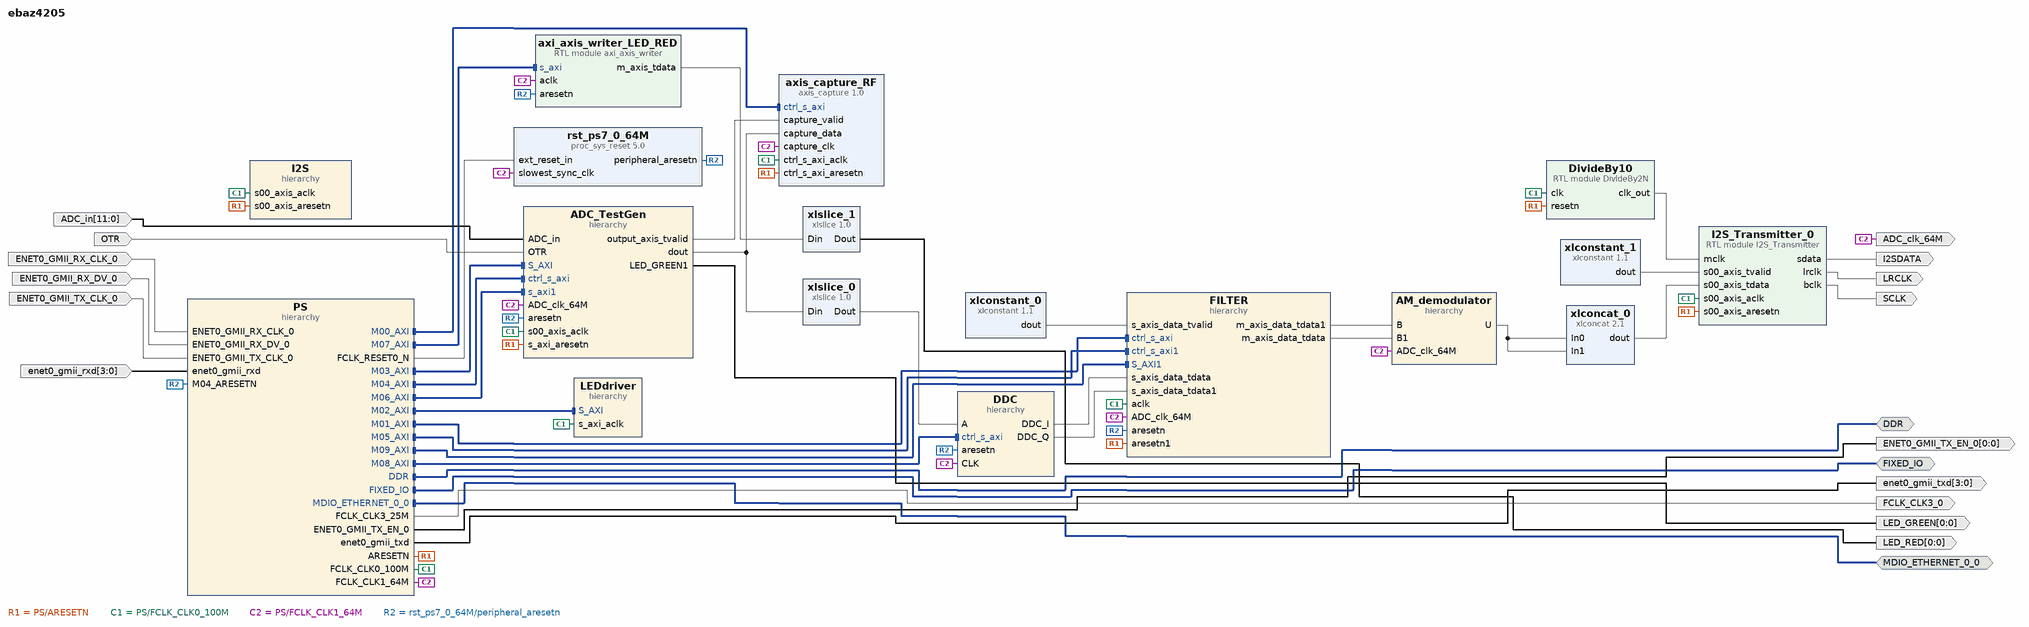
[diagram p0: block diagram of the top level]
# Vivado block design ebaz4205, xc7z010clg400-1, Vivado 2021.2
create_bd_design ebaz4205

create_bd_intf_port -mode Master -vlnv xilinx.com:interface:ddrx_rtl:1.0 DDR
create_bd_intf_port -mode Master -vlnv xilinx.com:display_processing_system7:fixedio_rtl:1.0 FIXED_IO
create_bd_intf_port -mode Master -vlnv xilinx.com:interface:mdio_rtl:1.0 MDIO_ETHERNET_0_0
create_bd_port -dir I -type clk ENET0_GMII_RX_CLK_0
create_bd_port -dir I ENET0_GMII_RX_DV_0
create_bd_port -dir I -type clk ENET0_GMII_TX_CLK_0
create_bd_port -dir O -from 0 -to 0 ENET0_GMII_TX_EN_0
create_bd_port -dir I -from 3 -to 0 enet0_gmii_rxd
create_bd_port -dir O -from 3 -to 0 enet0_gmii_txd
create_bd_port -dir O -type clk FCLK_CLK3_0
set_property -dict {CONFIG.FREQ_HZ 25000000} [get_bd_ports FCLK_CLK3_0]
create_bd_port -dir O -type clk ADC_clk_64M
set_property -dict {CONFIG.FREQ_HZ 64000000} [get_bd_ports ADC_clk_64M]
create_bd_port -dir I -type data OTR
create_bd_port -dir I -from 11 -to 0 -type data ADC_in
create_bd_port -dir O SCLK
create_bd_port -dir O LRCLK
create_bd_port -dir O I2SDATA
create_bd_port -dir O -from 0 -to 0 -type data LED_GREEN
create_bd_port -dir O -from 0 -to 0 LED_RED

create_bd_cell -type hier PS
create_bd_cell -type ip -vlnv xilinx.com:user:axis_capture:1.0 axis_capture_RF
set_property -dict {CONFIG.C_CAPTURE_NUM_WORDS_EXP2 14} [get_bd_cells axis_capture_RF]
create_bd_cell -type hier ADC_TestGen
create_bd_cell -type hier LEDdriver
create_bd_cell -type hier I2S
create_bd_cell -type hier DDC
create_bd_cell -type ip -vlnv xilinx.com:ip:xlslice:1.0 xlslice_0
set_property -dict {CONFIG.DIN_FROM 31 CONFIG.DIN_TO 20 CONFIG.DOUT_WIDTH 12} [get_bd_cells xlslice_0]
create_bd_cell -type ip -vlnv xilinx.com:ip:xlconstant:1.1 xlconstant_0
create_bd_cell -type hier AM_demodulator
create_bd_cell -type module -reference I2S_Transmitter I2S_Transmitter_0
create_bd_cell -type ip -vlnv xilinx.com:ip:xlconcat:2.1 xlconcat_0
set_property -dict {CONFIG.IN0_WIDTH 16 CONFIG.IN1_WIDTH 16} [get_bd_cells xlconcat_0]
create_bd_cell -type module -reference DivideBy2N DivideBy10
set_property -dict {CONFIG.N 5 CONFIG.WIDTH 3} [get_bd_cells DivideBy10]
create_bd_cell -type ip -vlnv xilinx.com:ip:xlconstant:1.1 xlconstant_1
create_bd_cell -type ip -vlnv xilinx.com:ip:proc_sys_reset:5.0 rst_ps7_0_64M
create_bd_cell -type hier FILTER
create_bd_cell -type module -reference axi_axis_writer axi_axis_writer_LED_RED
set_property -dict {CONFIG.AXI_DATA_WIDTH 32} [get_bd_cells axi_axis_writer_LED_RED]
create_bd_cell -type ip -vlnv xilinx.com:ip:xlslice:1.0 xlslice_1

# ---- hierarchy /PS ----
current_bd_instance /PS
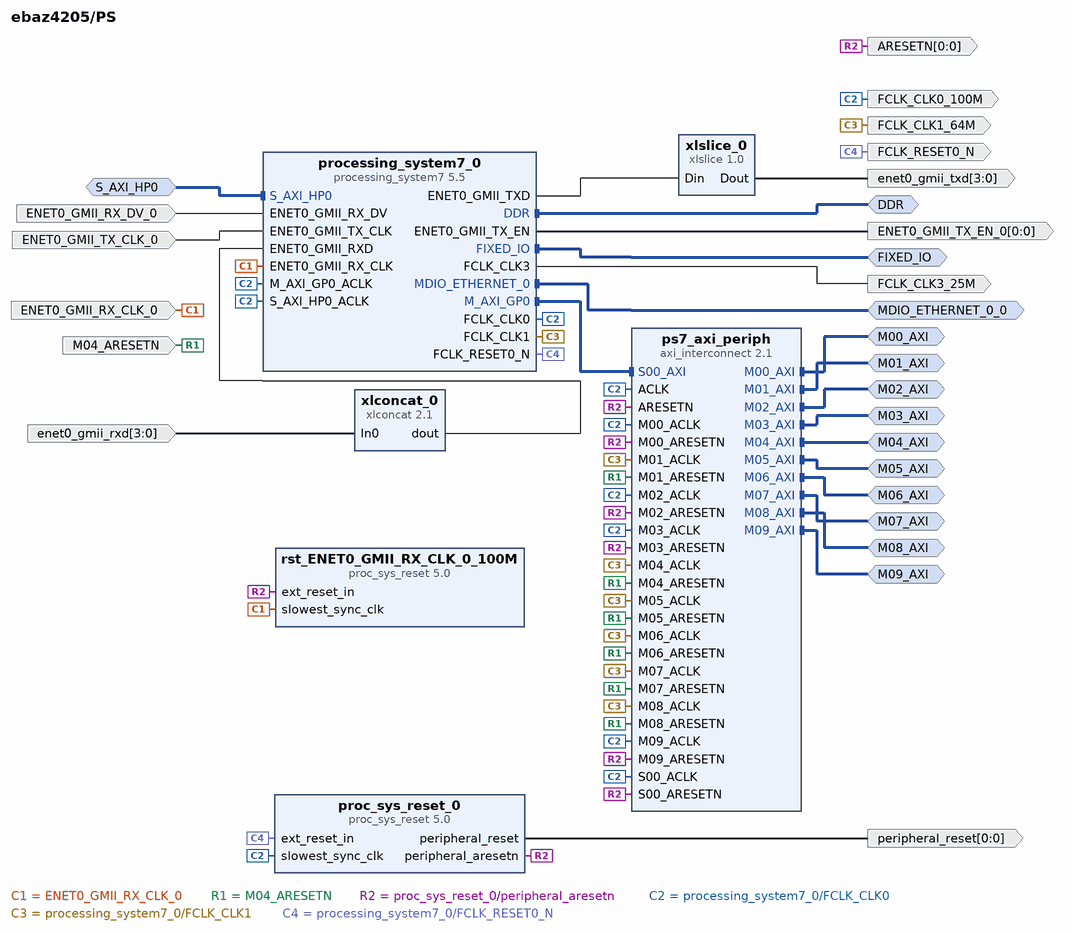
[diagram p1: block diagram inside /PS]
create_bd_intf_pin -mode Master -vlnv xilinx.com:interface:mdio_rtl:1.0 MDIO_ETHERNET_0_0
create_bd_intf_pin -mode Master -vlnv xilinx.com:interface:ddrx_rtl:1.0 DDR
create_bd_intf_pin -mode Master -vlnv xilinx.com:display_processing_system7:fixedio_rtl:1.0 FIXED_IO
create_bd_intf_pin -mode Master -vlnv xilinx.com:interface:aximm_rtl:1.0 M00_AXI
create_bd_intf_pin -mode Master -vlnv xilinx.com:interface:aximm_rtl:1.0 M01_AXI
create_bd_intf_pin -mode Master -vlnv xilinx.com:interface:aximm_rtl:1.0 M02_AXI
create_bd_intf_pin -mode Slave -vlnv xilinx.com:interface:aximm_rtl:1.0 S_AXI_HP0
create_bd_intf_pin -mode Master -vlnv xilinx.com:interface:aximm_rtl:1.0 M03_AXI
create_bd_intf_pin -mode Master -vlnv xilinx.com:interface:aximm_rtl:1.0 M04_AXI
create_bd_intf_pin -mode Master -vlnv xilinx.com:interface:aximm_rtl:1.0 M05_AXI
create_bd_intf_pin -mode Master -vlnv xilinx.com:interface:aximm_rtl:1.0 M06_AXI
create_bd_intf_pin -mode Master -vlnv xilinx.com:interface:aximm_rtl:1.0 M07_AXI
create_bd_intf_pin -mode Master -vlnv xilinx.com:interface:aximm_rtl:1.0 M08_AXI
create_bd_intf_pin -mode Master -vlnv xilinx.com:interface:aximm_rtl:1.0 M09_AXI
create_bd_pin -dir O -from 0 -to 0 ENET0_GMII_TX_EN_0
create_bd_pin -dir I -type clk ENET0_GMII_RX_CLK_0
create_bd_pin -dir I ENET0_GMII_RX_DV_0
create_bd_pin -dir I -type clk ENET0_GMII_TX_CLK_0
create_bd_pin -dir O -type clk FCLK_CLK0_100M
create_bd_pin -dir O -type clk FCLK_CLK3_25M
create_bd_pin -dir O -from 3 -to 0 enet0_gmii_txd
create_bd_pin -dir O -from 0 -to 0 -type rst ARESETN
create_bd_pin -dir I -from 3 -to 0 enet0_gmii_rxd
create_bd_pin -dir O -type clk FCLK_CLK1_64M
create_bd_pin -dir O -from 0 -to 0 -type rst peripheral_reset
create_bd_pin -dir O -type rst FCLK_RESET0_N
create_bd_pin -dir I -type rst M04_ARESETN

create_bd_cell -type ip -vlnv xilinx.com:ip:xlslice:1.0 xlslice_0
set_property -dict {CONFIG.DIN_FROM 3 CONFIG.DIN_TO 0 CONFIG.DIN_WIDTH 8 CONFIG.DOUT_WIDTH 4} [get_bd_cells xlslice_0]
create_bd_cell -type ip -vlnv xilinx.com:ip:proc_sys_reset:5.0 proc_sys_reset_0
create_bd_cell -type ip -vlnv xilinx.com:ip:processing_system7:5.5 processing_system7_0
set_property -dict [list \
  CONFIG.PCW_ENET0_ENET0_IO EMIO \
  CONFIG.PCW_ENET0_GRP_MDIO_ENABLE 1 \
  CONFIG.PCW_ENET0_GRP_MDIO_IO EMIO \
  CONFIG.PCW_ENET0_PERIPHERAL_ENABLE 1 \
  CONFIG.PCW_ENET0_PERIPHERAL_FREQMHZ {100 Mbps} \
  CONFIG.PCW_ENET0_RESET_ENABLE 0 \
  CONFIG.PCW_ENET_RESET_ENABLE 1 \
  CONFIG.PCW_ENET_RESET_SELECT {Share reset pin} \
  CONFIG.PCW_EN_CLK1_PORT 1 \
  CONFIG.PCW_EN_CLK3_PORT 1 \
  CONFIG.PCW_FCLK_CLK1_BUF TRUE \
  CONFIG.PCW_FCLK_CLK3_BUF TRUE \
  CONFIG.PCW_FPGA0_PERIPHERAL_FREQMHZ 100 \
  CONFIG.PCW_FPGA1_PERIPHERAL_FREQMHZ 64 \
  CONFIG.PCW_FPGA2_PERIPHERAL_FREQMHZ 1.5 \
  CONFIG.PCW_FPGA3_PERIPHERAL_FREQMHZ 25 \
  CONFIG.PCW_FPGA_FCLK1_ENABLE 1 \
  CONFIG.PCW_FPGA_FCLK3_ENABLE 1 \
  CONFIG.PCW_GPIO_EMIO_GPIO_ENABLE 1 \
  CONFIG.PCW_GPIO_EMIO_GPIO_IO 64 \
  CONFIG.PCW_GPIO_MIO_GPIO_ENABLE 1 \
  CONFIG.PCW_GPIO_MIO_GPIO_IO MIO \
  CONFIG.PCW_I2C_RESET_ENABLE 1 \
  CONFIG.PCW_NAND_NAND_IO {MIO 0 2.. 14} \
  CONFIG.PCW_NAND_PERIPHERAL_ENABLE 1 \
  CONFIG.PCW_SD0_GRP_CD_ENABLE 1 \
  CONFIG.PCW_SD0_GRP_CD_IO {MIO 34} \
  CONFIG.PCW_SD0_GRP_WP_ENABLE 0 \
  CONFIG.PCW_SD0_PERIPHERAL_ENABLE 1 \
  CONFIG.PCW_SD0_SD0_IO {MIO 40 .. 45} \
  CONFIG.PCW_SDIO_PERIPHERAL_FREQMHZ 25 \
  CONFIG.PCW_UART1_PERIPHERAL_ENABLE 1 \
  CONFIG.PCW_UART1_UART1_IO {MIO 24 .. 25} \
  CONFIG.PCW_UART_PERIPHERAL_FREQMHZ 100 \
  CONFIG.PCW_UIPARAM_DDR_BUS_WIDTH {16 Bit} \
  CONFIG.PCW_UIPARAM_DDR_PARTNO {MT41K128M16 JT-125} \
  CONFIG.PCW_USB_RESET_ENABLE 1 \
  CONFIG.PCW_USE_S_AXI_HP0 1 \
] [get_bd_cells processing_system7_0]
# 213 more settings of processing_system7_0 are not shown: defaults, MIO pin electricals, DDR timing, and values the tool derives
create_bd_cell -type ip -vlnv xilinx.com:ip:xlconcat:2.1 xlconcat_0
set_property -dict {CONFIG.IN0_WIDTH 4 CONFIG.IN1_WIDTH 4 CONFIG.NUM_PORTS 2} [get_bd_cells xlconcat_0]
create_bd_cell -type ip -vlnv xilinx.com:ip:axi_interconnect:2.1 ps7_axi_periph
set_property -dict {CONFIG.NUM_MI 10 CONFIG.NUM_SI 1} [get_bd_cells ps7_axi_periph]
create_bd_cell -type ip -vlnv xilinx.com:ip:proc_sys_reset:5.0 rst_ENET0_GMII_RX_CLK_0_100M

# ---- hierarchy /ADC_TestGen ----
current_bd_instance /ADC_TestGen
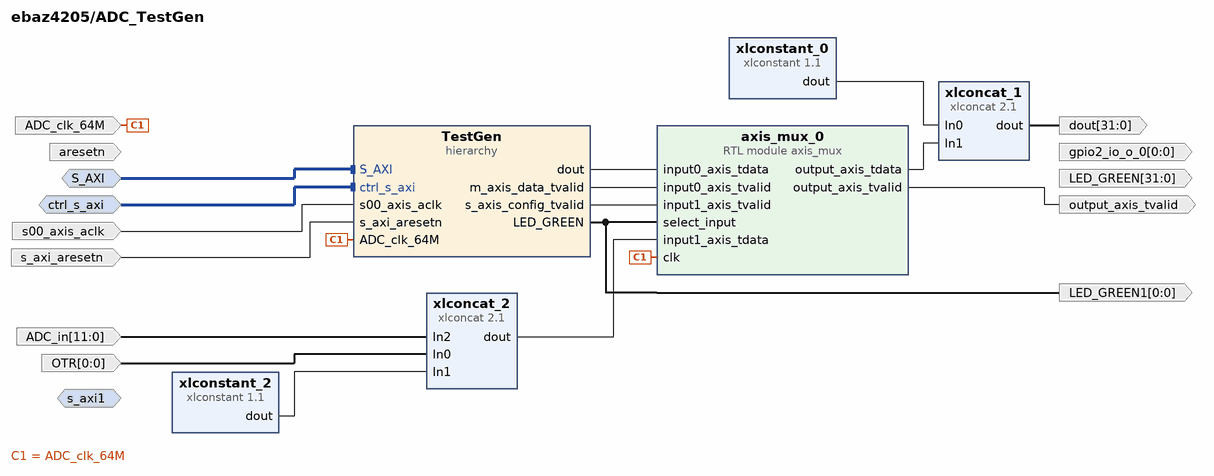
[diagram p2: block diagram inside /ADC_TestGen]
create_bd_intf_pin -mode Slave -vlnv xilinx.com:interface:aximm_rtl:1.0 S_AXI
create_bd_intf_pin -mode Slave -vlnv xilinx.com:interface:aximm_rtl:1.0 s_axi1
create_bd_intf_pin -mode Slave -vlnv xilinx.com:interface:aximm_rtl:1.0 ctrl_s_axi
create_bd_pin -dir O -from 31 -to 0 dout
create_bd_pin -dir O output_axis_tvalid
create_bd_pin -dir I -type clk ADC_clk_64M
create_bd_pin -dir I -from 0 -to 0 -type data OTR
create_bd_pin -dir I -from 11 -to 0 -type data ADC_in
create_bd_pin -dir I -type clk s00_axis_aclk
create_bd_pin -dir I -type rst s_axi_aresetn
create_bd_pin -dir O -from 0 -to 0 gpio2_io_o_0
create_bd_pin -dir O -from 31 -to 0 LED_GREEN
create_bd_pin -dir O -from 0 -to 0 LED_GREEN1
create_bd_pin -dir I -type rst aresetn

create_bd_cell -type ip -vlnv xilinx.com:ip:xlconcat:2.1 xlconcat_1
set_property -dict {CONFIG.IN0_WIDTH 16 CONFIG.IN1_WIDTH 16} [get_bd_cells xlconcat_1]
create_bd_cell -type ip -vlnv xilinx.com:ip:xlconstant:1.1 xlconstant_0
set_property -dict {CONFIG.CONST_VAL 0 CONFIG.CONST_WIDTH 16} [get_bd_cells xlconstant_0]
create_bd_cell -type ip -vlnv xilinx.com:ip:xlconstant:1.1 xlconstant_2
set_property -dict {CONFIG.CONST_VAL b000 CONFIG.CONST_WIDTH 3} [get_bd_cells xlconstant_2]
create_bd_cell -type module -reference axis_mux axis_mux_0
create_bd_cell -type ip -vlnv xilinx.com:ip:xlconcat:2.1 xlconcat_2
set_property -dict {CONFIG.IN0_WIDTH 1 CONFIG.IN1_WIDTH 3 CONFIG.IN2_WIDTH 12 CONFIG.NUM_PORTS 3} [get_bd_cells xlconcat_2]
create_bd_cell -type hier TestGen

# ---- hierarchy /ADC_TestGen/TestGen ----
current_bd_instance /ADC_TestGen/TestGen
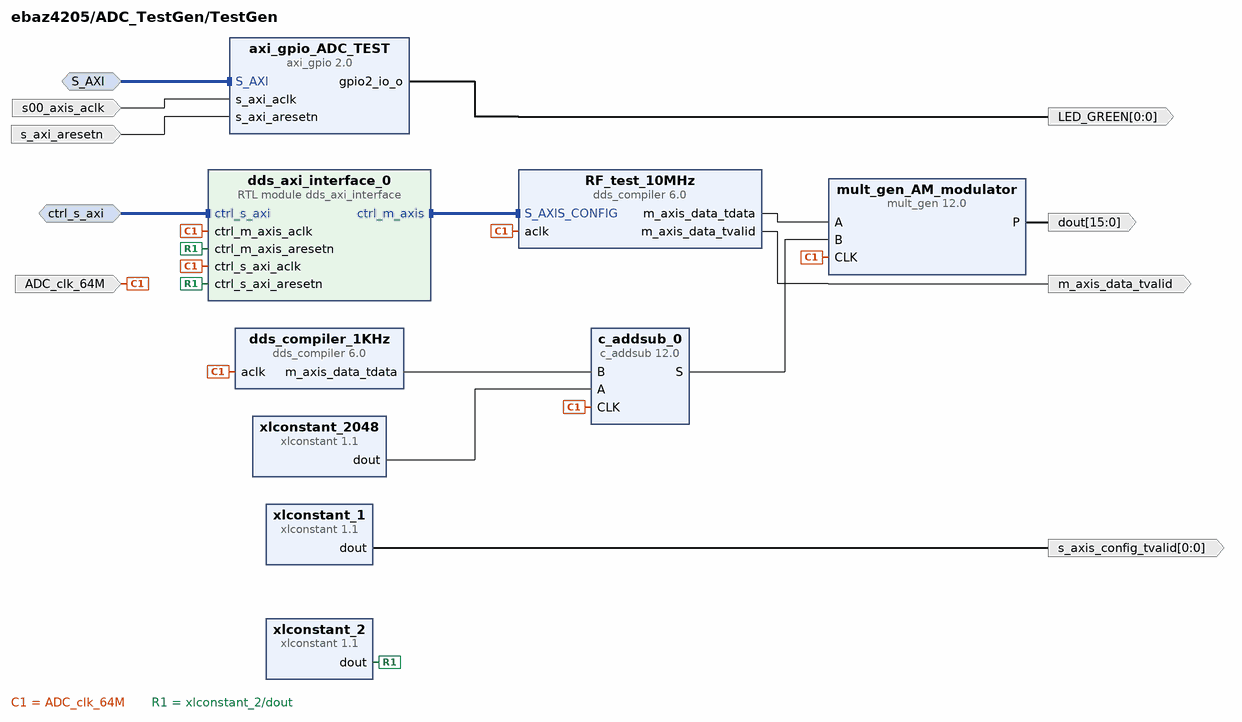
[diagram p3: block diagram inside /ADC_TestGen/TestGen]
create_bd_intf_pin -mode Slave -vlnv xilinx.com:interface:aximm_rtl:1.0 S_AXI
create_bd_intf_pin -mode Slave -vlnv xilinx.com:interface:aximm_rtl:1.0 ctrl_s_axi
create_bd_pin -dir O -from 0 -to 0 s_axis_config_tvalid
create_bd_pin -dir I -type clk ADC_clk_64M
create_bd_pin -dir O m_axis_data_tvalid
create_bd_pin -dir I -type clk s00_axis_aclk
create_bd_pin -dir O -from 15 -to 0 dout
create_bd_pin -dir I -type rst s_axi_aresetn
create_bd_pin -dir O -from 0 -to 0 LED_GREEN

create_bd_cell -type ip -vlnv xilinx.com:ip:xlconstant:1.1 xlconstant_1
set_property -dict {CONFIG.CONST_VAL 1 CONFIG.CONST_WIDTH 1} [get_bd_cells xlconstant_1]
create_bd_cell -type ip -vlnv xilinx.com:ip:xlconstant:1.1 xlconstant_2048
set_property -dict {CONFIG.CONST_VAL 2048 CONFIG.CONST_WIDTH 16} [get_bd_cells xlconstant_2048]
create_bd_cell -type ip -vlnv xilinx.com:ip:dds_compiler:6.0 RF_test_10MHz
set_property -dict [list \
  CONFIG.DATA_Has_TLAST Not_Required \
  CONFIG.DDS_Clock_Rate 64 \
  CONFIG.Frequency_Resolution 1 \
  CONFIG.Has_Phase_Out false \
  CONFIG.Latency 7 \
  CONFIG.M_DATA_Has_TUSER Not_Required \
  CONFIG.Noise_Shaping Auto \
  CONFIG.OUTPUT_FORM Twos_Complement \
  CONFIG.Output_Frequency1 10 \
  CONFIG.Output_Selection Sine \
  CONFIG.Output_Width 12 \
  CONFIG.PINC1 101000000000000000000000 \
  CONFIG.Parameter_Entry System_Parameters \
  CONFIG.Phase_Increment Programmable \
  CONFIG.Phase_Width 26 \
  CONFIG.Phase_offset None \
  CONFIG.S_PHASE_Has_TUSER Not_Required \
  CONFIG.Spurious_Free_Dynamic_Range 70 \
] [get_bd_cells RF_test_10MHz]
create_bd_cell -type ip -vlnv xilinx.com:ip:axi_gpio:2.0 axi_gpio_ADC_TEST
set_property -dict [list \
  CONFIG.C_ALL_OUTPUTS 1 \
  CONFIG.C_ALL_OUTPUTS_2 1 \
  CONFIG.C_DOUT_DEFAULT 0x00A00000 \
  CONFIG.C_GPIO2_WIDTH 1 \
  CONFIG.C_IS_DUAL 1 \
] [get_bd_cells axi_gpio_ADC_TEST]
create_bd_cell -type ip -vlnv xilinx.com:ip:dds_compiler:6.0 dds_compiler_1KHz
set_property -dict [list \
  CONFIG.Amplitude_Mode Full_Range \
  CONFIG.DDS_Clock_Rate 64 \
  CONFIG.Frequency_Resolution 0.4 \
  CONFIG.Has_Phase_Out false \
  CONFIG.Latency 7 \
  CONFIG.M_DATA_Has_TUSER Not_Required \
  CONFIG.Noise_Shaping Auto \
  CONFIG.Output_Frequency1 0.001 \
  CONFIG.Output_Selection Sine \
  CONFIG.Output_Width 12 \
  CONFIG.PINC1 1000001100010 \
  CONFIG.Parameter_Entry System_Parameters \
  CONFIG.Phase_Width 28 \
  CONFIG.Spurious_Free_Dynamic_Range 70 \
] [get_bd_cells dds_compiler_1KHz]
create_bd_cell -type ip -vlnv xilinx.com:ip:c_addsub:12.0 c_addsub_0
set_property -dict [list \
  CONFIG.A_Width 16 \
  CONFIG.B_Value 0000000000000000 \
  CONFIG.B_Width 16 \
  CONFIG.CE false \
  CONFIG.Latency 1 \
  CONFIG.Out_Width 16 \
] [get_bd_cells c_addsub_0]
create_bd_cell -type ip -vlnv xilinx.com:ip:mult_gen:12.0 mult_gen_AM_modulator
set_property -dict [list \
  CONFIG.OptGoal Area \
  CONFIG.OutputWidthHigh 24 \
  CONFIG.OutputWidthLow 9 \
  CONFIG.PortAWidth 16 \
  CONFIG.PortBWidth 16 \
  CONFIG.Use_Custom_Output_Width true \
] [get_bd_cells mult_gen_AM_modulator]
create_bd_cell -type module -reference dds_axi_interface dds_axi_interface_0
create_bd_cell -type ip -vlnv xilinx.com:ip:xlconstant:1.1 xlconstant_2

# ---- hierarchy /LEDdriver ----
current_bd_instance /LEDdriver
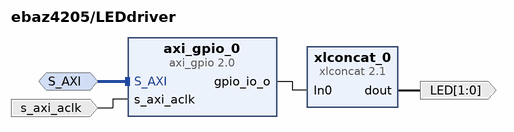
[diagram p4: block diagram inside /LEDdriver]
create_bd_intf_pin -mode Slave -vlnv xilinx.com:interface:aximm_rtl:1.0 S_AXI
create_bd_pin -dir I -type clk s_axi_aclk
create_bd_pin -dir O -from 1 -to 0 LED

create_bd_cell -type ip -vlnv xilinx.com:ip:axi_gpio:2.0 axi_gpio_0
set_property -dict {CONFIG.C_GPIO_WIDTH 1} [get_bd_cells axi_gpio_0]
create_bd_cell -type ip -vlnv xilinx.com:ip:xlconcat:2.1 xlconcat_0

# ---- hierarchy /I2S ----
current_bd_instance /I2S
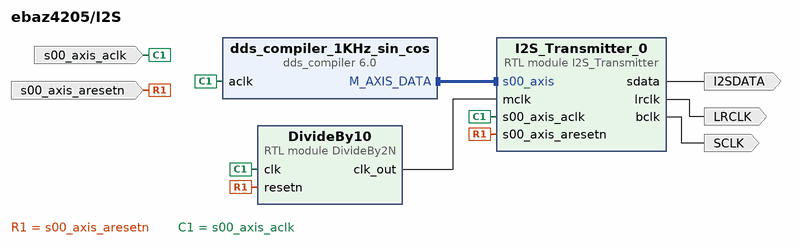
[diagram p5: block diagram inside /I2S]
create_bd_pin -dir I -type clk s00_axis_aclk
create_bd_pin -dir I -type rst s00_axis_aresetn
create_bd_pin -dir O SCLK
create_bd_pin -dir O LRCLK
create_bd_pin -dir O I2SDATA

create_bd_cell -type module -reference DivideBy2N DivideBy10
set_property -dict {CONFIG.N 5} [get_bd_cells DivideBy10]
create_bd_cell -type ip -vlnv xilinx.com:ip:dds_compiler:6.0 dds_compiler_1KHz_sin_cos
set_property -dict [list \
  CONFIG.Has_Phase_Out false \
  CONFIG.Latency 8 \
  CONFIG.M_DATA_Has_TUSER Not_Required \
  CONFIG.Noise_Shaping Auto \
  CONFIG.Output_Frequency1 0.001 \
  CONFIG.Output_Width 16 \
  CONFIG.PINC1 101001111100 \
  CONFIG.Phase_Width 28 \
  CONFIG.Spurious_Free_Dynamic_Range 95 \
] [get_bd_cells dds_compiler_1KHz_sin_cos]
create_bd_cell -type module -reference I2S_Transmitter I2S_Transmitter_0

# ---- hierarchy /DDC ----
current_bd_instance /DDC
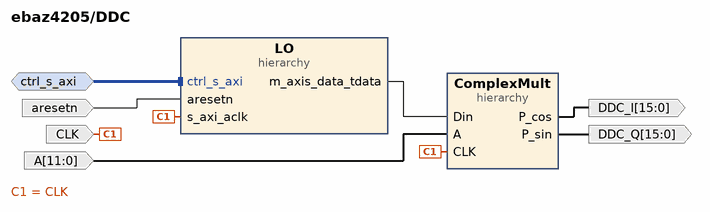
[diagram p6: block diagram inside /DDC]
create_bd_intf_pin -mode Slave -vlnv xilinx.com:interface:aximm_rtl:1.0 ctrl_s_axi
create_bd_pin -dir I -from 11 -to 0 -type data A
create_bd_pin -dir I -type clk CLK
create_bd_pin -dir O -from 15 -to 0 -type data DDC_I
create_bd_pin -dir O -from 15 -to 0 -type data DDC_Q
create_bd_pin -dir I -type rst aresetn

create_bd_cell -type hier LO
create_bd_cell -type hier ComplexMult

# ---- hierarchy /DDC/LO ----
current_bd_instance /DDC/LO
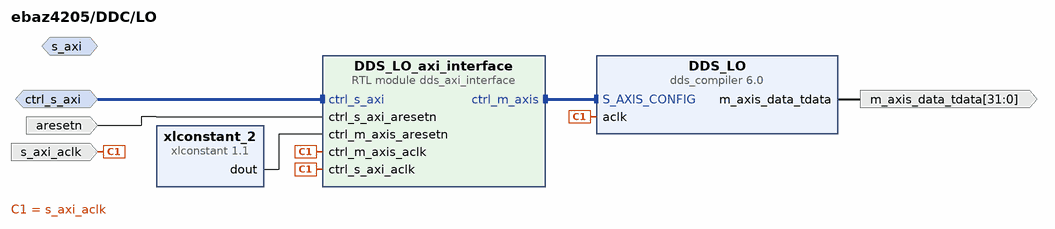
[diagram p7: block diagram inside /DDC/LO]
create_bd_intf_pin -mode Slave -vlnv xilinx.com:interface:aximm_rtl:1.0 s_axi
create_bd_intf_pin -mode Slave -vlnv xilinx.com:interface:aximm_rtl:1.0 ctrl_s_axi
create_bd_pin -dir I -type clk s_axi_aclk
create_bd_pin -dir O -from 31 -to 0 m_axis_data_tdata
create_bd_pin -dir I -type rst aresetn

create_bd_cell -type ip -vlnv xilinx.com:ip:dds_compiler:6.0 DDS_LO
set_property -dict [list \
  CONFIG.DATA_Has_TLAST Not_Required \
  CONFIG.DDS_Clock_Rate 64 \
  CONFIG.Frequency_Resolution 1 \
  CONFIG.Has_Phase_Out false \
  CONFIG.Latency 8 \
  CONFIG.M_DATA_Has_TUSER Not_Required \
  CONFIG.Noise_Shaping Auto \
  CONFIG.OUTPUT_FORM Twos_Complement \
  CONFIG.Output_Frequency1 10.010 \
  CONFIG.Output_Selection Sine_and_Cosine \
  CONFIG.Output_Width 16 \
  CONFIG.PINC1 101000000010100011110101 \
  CONFIG.Parameter_Entry System_Parameters \
  CONFIG.Phase_Increment Programmable \
  CONFIG.Phase_Width 26 \
  CONFIG.Phase_offset None \
  CONFIG.S_PHASE_Has_TUSER Not_Required \
  CONFIG.Spurious_Free_Dynamic_Range 95 \
] [get_bd_cells DDS_LO]
create_bd_cell -type module -reference dds_axi_interface DDS_LO_axi_interface
create_bd_cell -type ip -vlnv xilinx.com:ip:xlconstant:1.1 xlconstant_2

# ---- hierarchy /DDC/ComplexMult ----
current_bd_instance /DDC/ComplexMult
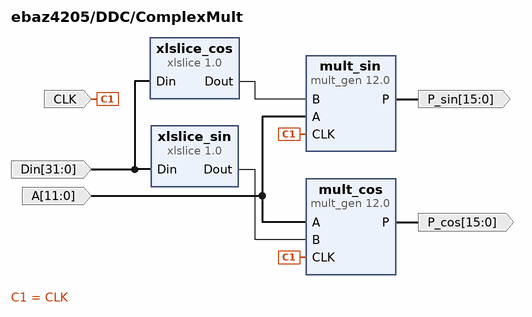
[diagram p8: block diagram inside /DDC/ComplexMult]
create_bd_pin -dir I -from 31 -to 0 Din
create_bd_pin -dir I -type clk CLK
create_bd_pin -dir I -from 11 -to 0 -type data A
create_bd_pin -dir O -from 15 -to 0 -type data P_cos
create_bd_pin -dir O -from 15 -to 0 -type data P_sin

create_bd_cell -type ip -vlnv xilinx.com:ip:xlslice:1.0 xlslice_sin
set_property -dict {CONFIG.DIN_FROM 31 CONFIG.DIN_TO 16 CONFIG.DOUT_WIDTH 16} [get_bd_cells xlslice_sin]
create_bd_cell -type ip -vlnv xilinx.com:ip:mult_gen:12.0 mult_cos
set_property -dict [list \
  CONFIG.MultType Parallel_Multiplier \
  CONFIG.OutputWidthHigh 26 \
  CONFIG.OutputWidthLow 11 \
  CONFIG.PortAWidth 12 \
  CONFIG.PortBWidth 16 \
  CONFIG.Use_Custom_Output_Width true \
] [get_bd_cells mult_cos]
create_bd_cell -type ip -vlnv xilinx.com:ip:mult_gen:12.0 mult_sin
set_property -dict [list \
  CONFIG.OutputWidthHigh 26 \
  CONFIG.OutputWidthLow 11 \
  CONFIG.PortAWidth 12 \
  CONFIG.PortBWidth 16 \
  CONFIG.Use_Custom_Output_Width true \
] [get_bd_cells mult_sin]
create_bd_cell -type ip -vlnv xilinx.com:ip:xlslice:1.0 xlslice_cos
set_property -dict {CONFIG.DIN_FROM 15 CONFIG.DIN_TO 0 CONFIG.DOUT_WIDTH 16} [get_bd_cells xlslice_cos]

# ---- hierarchy /AM_demodulator ----
current_bd_instance /AM_demodulator
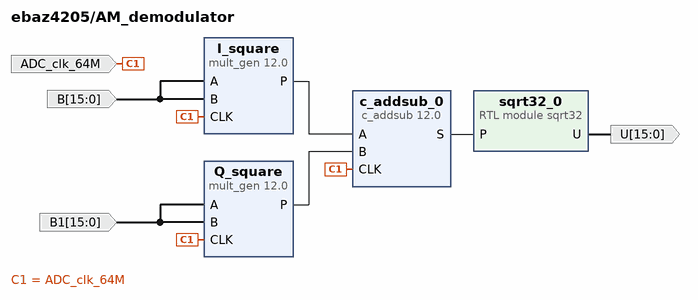
[diagram p9: block diagram inside /AM_demodulator]
create_bd_pin -dir I -type clk ADC_clk_64M
create_bd_pin -dir I -from 15 -to 0 -type data B
create_bd_pin -dir I -from 15 -to 0 -type data B1
create_bd_pin -dir O -from 15 -to 0 U

create_bd_cell -type module -reference sqrt32 sqrt32_0
create_bd_cell -type ip -vlnv xilinx.com:ip:mult_gen:12.0 I_square
set_property -dict {CONFIG.PortAType Signed CONFIG.PortAWidth 16 CONFIG.PortBWidth 16} [get_bd_cells I_square]
create_bd_cell -type ip -vlnv xilinx.com:ip:c_addsub:12.0 c_addsub_0
set_property -dict [list \
  CONFIG.A_Type Signed \
  CONFIG.A_Width 32 \
  CONFIG.B_Type Signed \
  CONFIG.B_Value 00000000000000000000000000000000 \
  CONFIG.B_Width 32 \
  CONFIG.CE false \
  CONFIG.Latency 1 \
  CONFIG.Out_Width 32 \
] [get_bd_cells c_addsub_0]
create_bd_cell -type ip -vlnv xilinx.com:ip:mult_gen:12.0 Q_square
set_property -dict {CONFIG.PortAWidth 16 CONFIG.PortBWidth 16} [get_bd_cells Q_square]

# ---- hierarchy /FILTER ----
current_bd_instance /FILTER
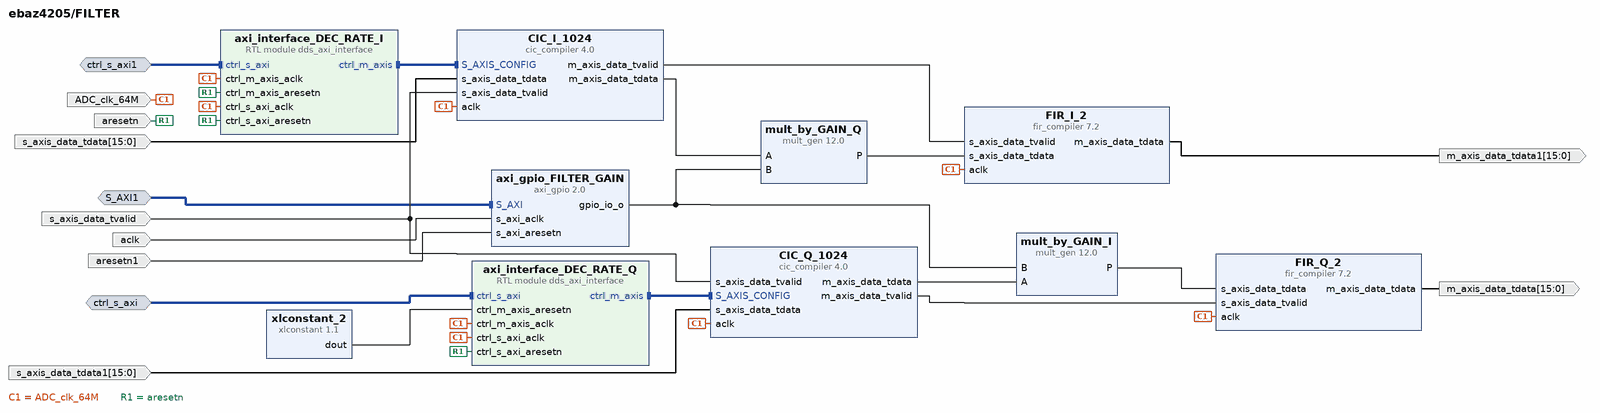
[diagram p10: block diagram inside /FILTER]
create_bd_intf_pin -mode Slave -vlnv xilinx.com:interface:aximm_rtl:1.0 S_AXI1
create_bd_intf_pin -mode Slave -vlnv xilinx.com:interface:aximm_rtl:1.0 ctrl_s_axi
create_bd_intf_pin -mode Slave -vlnv xilinx.com:interface:aximm_rtl:1.0 ctrl_s_axi1
create_bd_pin -dir I -type clk ADC_clk_64M
create_bd_pin -dir I -type rst aresetn
create_bd_pin -dir O -from 15 -to 0 m_axis_data_tdata
create_bd_pin -dir I -from 15 -to 0 s_axis_data_tdata
create_bd_pin -dir I s_axis_data_tvalid
create_bd_pin -dir I -from 15 -to 0 s_axis_data_tdata1
create_bd_pin -dir O -from 15 -to 0 m_axis_data_tdata1
create_bd_pin -dir I -type clk aclk
create_bd_pin -dir I -type rst aresetn1

create_bd_cell -type ip -vlnv xilinx.com:ip:fir_compiler:7.2 FIR_Q_2
set_property -dict [list \
  CONFIG.BestPrecision true \
  CONFIG.Channel_Sequence Basic \
  CONFIG.Clock_Frequency 64 \
  CONFIG.CoefficientSource COE_File \
  CONFIG.Coefficient_File ../../../../../../../../matlab/mycoefile.coe \
  CONFIG.Coefficient_Fractional_Bits 0 \
  CONFIG.Coefficient_Sets 1 \
  CONFIG.Coefficient_Sign Signed \
  CONFIG.Coefficient_Structure Symmetric \
  CONFIG.Coefficient_Width 16 \
  CONFIG.ColumnConfig 28 \
  CONFIG.DATA_Has_TLAST Not_Required \
  CONFIG.Data_Width 16 \
  CONFIG.Decimation_Rate 2 \
  CONFIG.Filter_Architecture Systolic_Multiply_Accumulate \
  CONFIG.Filter_Type Decimation \
  CONFIG.Interpolation_Rate 1 \
  CONFIG.M_DATA_Has_TUSER Not_Required \
  CONFIG.Number_Channels 1 \
  CONFIG.Output_Rounding_Mode Truncate_LSBs \
  CONFIG.Output_Width 16 \
  CONFIG.Quantization Maximize_Dynamic_Range \
  CONFIG.RateSpecification Frequency_Specification \
  CONFIG.S_DATA_Has_TUSER Not_Required \
  CONFIG.Sample_Frequency 64 \
  CONFIG.Select_Pattern All \
  CONFIG.Zero_Pack_Factor 1 \
] [get_bd_cells FIR_Q_2]
create_bd_cell -type ip -vlnv xilinx.com:ip:cic_compiler:4.0 CIC_I_1024
set_property -dict [list \
  CONFIG.Clock_Frequency 64 \
  CONFIG.Filter_Type Decimation \
  CONFIG.Fixed_Or_Initial_Rate 1024 \
  CONFIG.HAS_DOUT_TREADY false \
  CONFIG.Input_Data_Width 16 \
  CONFIG.Input_Sample_Frequency 64 \
  CONFIG.Maximum_Rate 8192 \
  CONFIG.Minimum_Rate 4 \
  CONFIG.Number_Of_Channels 1 \
  CONFIG.Number_Of_Stages 6 \
  CONFIG.Output_Data_Width 16 \
  CONFIG.Quantization Truncation \
  CONFIG.Response_Magnitude Normalized \
  CONFIG.SamplePeriod 1 \
  CONFIG.Sample_Rate_Changes Programmable \
  CONFIG.Use_Xtreme_DSP_Slice false \
] [get_bd_cells CIC_I_1024]
create_bd_cell -type ip -vlnv xilinx.com:ip:cic_compiler:4.0 CIC_Q_1024
set_property -dict [list \
  CONFIG.Clock_Frequency 64 \
  CONFIG.Filter_Type Decimation \
  CONFIG.Fixed_Or_Initial_Rate 1024 \
  CONFIG.HAS_DOUT_TREADY false \
  CONFIG.Input_Data_Width 16 \
  CONFIG.Input_Sample_Frequency 64 \
  CONFIG.Maximum_Rate 8192 \
  CONFIG.Minimum_Rate 4 \
  CONFIG.Number_Of_Channels 1 \
  CONFIG.Number_Of_Stages 6 \
  CONFIG.Output_Data_Width 16 \
  CONFIG.Quantization Truncation \
  CONFIG.SamplePeriod 1 \
  CONFIG.Sample_Rate_Changes Programmable \
  CONFIG.Use_Xtreme_DSP_Slice false \
] [get_bd_cells CIC_Q_1024]
create_bd_cell -type ip -vlnv xilinx.com:ip:fir_compiler:7.2 FIR_I_2
set_property -dict [list \
  CONFIG.BestPrecision false \
  CONFIG.Channel_Sequence Basic \
  CONFIG.Clock_Frequency 64 \
  CONFIG.CoefficientSource COE_File \
  CONFIG.Coefficient_File ../../../../../../../../matlab/mycoefile.coe \
  CONFIG.Coefficient_Fractional_Bits 0 \
  CONFIG.Coefficient_Reload false \
  CONFIG.Coefficient_Sets 1 \
  CONFIG.Coefficient_Sign Signed \
  CONFIG.Coefficient_Structure Symmetric \
  CONFIG.Coefficient_Width 16 \
  CONFIG.ColumnConfig 28 \
  CONFIG.DATA_Has_TLAST Not_Required \
  CONFIG.Data_Fractional_Bits 0 \
  CONFIG.Data_Width 16 \
  CONFIG.Decimation_Rate 2 \
  CONFIG.Filter_Architecture Systolic_Multiply_Accumulate \
  CONFIG.Filter_Type Decimation \
  CONFIG.Interpolation_Rate 1 \
  CONFIG.M_DATA_Has_TUSER Not_Required \
  CONFIG.Number_Channels 1 \
  CONFIG.Output_Rounding_Mode Truncate_LSBs \
  CONFIG.Output_Width 16 \
  CONFIG.Quantization Maximize_Dynamic_Range \
  CONFIG.RateSpecification Frequency_Specification \
  CONFIG.S_DATA_Has_TUSER Not_Required \
  CONFIG.Sample_Frequency 64 \
  CONFIG.Select_Pattern All \
  CONFIG.Zero_Pack_Factor 1 \
] [get_bd_cells FIR_I_2]
create_bd_cell -type ip -vlnv xilinx.com:ip:mult_gen:12.0 mult_by_GAIN_Q
set_property -dict [list \
  CONFIG.MultType Parallel_Multiplier \
  CONFIG.OutputWidthHigh 15 \
  CONFIG.PortAWidth 16 \
  CONFIG.PortBWidth 32 \
  CONFIG.Use_Custom_Output_Width true \
] [get_bd_cells mult_by_GAIN_Q]
create_bd_cell -type ip -vlnv xilinx.com:ip:mult_gen:12.0 mult_by_GAIN_I
set_property -dict [list \
  CONFIG.MultType Parallel_Multiplier \
  CONFIG.OutputWidthHigh 15 \
  CONFIG.PortAWidth 16 \
  CONFIG.PortBWidth 32 \
  CONFIG.Use_Custom_Output_Width true \
] [get_bd_cells mult_by_GAIN_I]
create_bd_cell -type ip -vlnv xilinx.com:ip:axi_gpio:2.0 axi_gpio_FILTER_GAIN
set_property -dict {CONFIG.C_ALL_OUTPUTS 1} [get_bd_cells axi_gpio_FILTER_GAIN]
create_bd_cell -type module -reference dds_axi_interface axi_interface_DEC_RATE_Q
set_property -dict [list \
  CONFIG.C_CTRL_M_AXIS_TDATA_WIDTH 16 \
  CONFIG.C_CTRL_M_AXIS_TDATA_WIDTH_INTERN 32 \
  CONFIG.C_CTRL_S_AXI_DATA_WIDTH 32 \
] [get_bd_cells axi_interface_DEC_RATE_Q]
create_bd_cell -type ip -vlnv xilinx.com:ip:xlconstant:1.1 xlconstant_2
create_bd_cell -type module -reference dds_axi_interface axi_interface_DEC_RATE_I
set_property -dict [list \
  CONFIG.C_CTRL_M_AXIS_TDATA_WIDTH 16 \
  CONFIG.C_CTRL_M_AXIS_TDATA_WIDTH_INTERN 32 \
  CONFIG.C_CTRL_S_AXI_DATA_WIDTH 32 \
] [get_bd_cells axi_interface_DEC_RATE_I]

# ---- connections ----

current_bd_instance /PS
connect_bd_intf_net [get_bd_intf_pins M01_AXI] [get_bd_intf_pins ps7_axi_periph/M01_AXI]
connect_bd_intf_net [get_bd_intf_pins M02_AXI] [get_bd_intf_pins ps7_axi_periph/M02_AXI]
connect_bd_intf_net [get_bd_intf_pins S_AXI_HP0] [get_bd_intf_pins processing_system7_0/S_AXI_HP0]
connect_bd_intf_net [get_bd_intf_pins M03_AXI] [get_bd_intf_pins ps7_axi_periph/M03_AXI]
connect_bd_intf_net [get_bd_intf_pins M05_AXI] [get_bd_intf_pins ps7_axi_periph/M05_AXI]
connect_bd_intf_net [get_bd_intf_pins M07_AXI] [get_bd_intf_pins ps7_axi_periph/M07_AXI]
connect_bd_intf_net [get_bd_intf_pins DDR] [get_bd_intf_pins processing_system7_0/DDR]
connect_bd_intf_net [get_bd_intf_pins FIXED_IO] [get_bd_intf_pins processing_system7_0/FIXED_IO]
connect_bd_intf_net [get_bd_intf_pins MDIO_ETHERNET_0_0] [get_bd_intf_pins processing_system7_0/MDIO_ETHERNET_0]
connect_bd_intf_net [get_bd_intf_pins processing_system7_0/M_AXI_GP0] [get_bd_intf_pins ps7_axi_periph/S00_AXI]
connect_bd_intf_net [get_bd_intf_pins M00_AXI] [get_bd_intf_pins ps7_axi_periph/M00_AXI]
connect_bd_intf_net [get_bd_intf_pins M04_AXI] [get_bd_intf_pins ps7_axi_periph/M04_AXI]
connect_bd_intf_net [get_bd_intf_pins M06_AXI] [get_bd_intf_pins ps7_axi_periph/M06_AXI]
connect_bd_intf_net [get_bd_intf_pins M08_AXI] [get_bd_intf_pins ps7_axi_periph/M08_AXI]
connect_bd_intf_net [get_bd_intf_pins M09_AXI] [get_bd_intf_pins ps7_axi_periph/M09_AXI]
connect_bd_net -net ENET0_GMII_RX_CLK_0_1 [get_bd_pins ENET0_GMII_RX_CLK_0] \
  [get_bd_pins processing_system7_0/ENET0_GMII_RX_CLK] [get_bd_pins rst_ENET0_GMII_RX_CLK_0_100M/slowest_sync_clk]
connect_bd_net -net ENET0_GMII_RX_DV_0_1 [get_bd_pins ENET0_GMII_RX_DV_0] [get_bd_pins processing_system7_0/ENET0_GMII_RX_DV]
connect_bd_net -net ENET0_GMII_TX_CLK_0_1 [get_bd_pins ENET0_GMII_TX_CLK_0] [get_bd_pins processing_system7_0/ENET0_GMII_TX_CLK]
connect_bd_net -net In0_0_1 [get_bd_pins enet0_gmii_rxd] [get_bd_pins xlconcat_0/In0]
connect_bd_net [get_bd_pins M04_ARESETN] \
  [get_bd_pins ps7_axi_periph/M04_ARESETN] [get_bd_pins ps7_axi_periph/M05_ARESETN] [get_bd_pins ps7_axi_periph/M06_ARESETN] \
  [get_bd_pins ps7_axi_periph/M07_ARESETN] [get_bd_pins ps7_axi_periph/M08_ARESETN] [get_bd_pins ps7_axi_periph/M01_ARESETN]
connect_bd_net [get_bd_pins proc_sys_reset_0/peripheral_aresetn] \
  [get_bd_pins ARESETN] [get_bd_pins ps7_axi_periph/S00_ARESETN] [get_bd_pins ps7_axi_periph/M00_ARESETN] \
  [get_bd_pins ps7_axi_periph/ARESETN] [get_bd_pins ps7_axi_periph/M02_ARESETN] [get_bd_pins ps7_axi_periph/M03_ARESETN] \
  [get_bd_pins rst_ENET0_GMII_RX_CLK_0_100M/ext_reset_in] [get_bd_pins ps7_axi_periph/M09_ARESETN]
connect_bd_net [get_bd_pins proc_sys_reset_0/peripheral_reset] [get_bd_pins peripheral_reset]
connect_bd_net [get_bd_pins processing_system7_0/ENET0_GMII_TXD] [get_bd_pins xlslice_0/Din]
connect_bd_net [get_bd_pins processing_system7_0/ENET0_GMII_TX_EN] [get_bd_pins ENET0_GMII_TX_EN_0]
connect_bd_net [get_bd_pins processing_system7_0/FCLK_CLK0] \
  [get_bd_pins FCLK_CLK0_100M] [get_bd_pins proc_sys_reset_0/slowest_sync_clk] [get_bd_pins ps7_axi_periph/ACLK] \
  [get_bd_pins ps7_axi_periph/S00_ACLK] [get_bd_pins ps7_axi_periph/M00_ACLK] \
  [get_bd_pins processing_system7_0/M_AXI_GP0_ACLK] [get_bd_pins processing_system7_0/S_AXI_HP0_ACLK] \
  [get_bd_pins ps7_axi_periph/M02_ACLK] [get_bd_pins ps7_axi_periph/M03_ACLK] [get_bd_pins ps7_axi_periph/M09_ACLK]
connect_bd_net [get_bd_pins processing_system7_0/FCLK_CLK1] \
  [get_bd_pins FCLK_CLK1_64M] [get_bd_pins ps7_axi_periph/M04_ACLK] [get_bd_pins ps7_axi_periph/M05_ACLK] \
  [get_bd_pins ps7_axi_periph/M06_ACLK] [get_bd_pins ps7_axi_periph/M07_ACLK] [get_bd_pins ps7_axi_periph/M08_ACLK] \
  [get_bd_pins ps7_axi_periph/M01_ACLK]
connect_bd_net [get_bd_pins processing_system7_0/FCLK_CLK3] [get_bd_pins FCLK_CLK3_25M]
connect_bd_net [get_bd_pins processing_system7_0/FCLK_RESET0_N] [get_bd_pins proc_sys_reset_0/ext_reset_in] [get_bd_pins FCLK_RESET0_N]
connect_bd_net [get_bd_pins xlconcat_0/dout] [get_bd_pins processing_system7_0/ENET0_GMII_RXD]
connect_bd_net [get_bd_pins xlslice_0/Dout] [get_bd_pins enet0_gmii_txd]

current_bd_instance /ADC_TestGen
connect_bd_intf_net [get_bd_intf_pins S_AXI] [get_bd_intf_pins TestGen/S_AXI]
connect_bd_intf_net [get_bd_intf_pins ctrl_s_axi] [get_bd_intf_pins TestGen/ctrl_s_axi]
connect_bd_net [get_bd_pins ADC_in] [get_bd_pins xlconcat_2/In2]
connect_bd_net -net ADCandTestGen_output_axis_tvalid [get_bd_pins axis_mux_0/output_axis_tvalid] [get_bd_pins output_axis_tvalid]
connect_bd_net [get_bd_pins OTR] [get_bd_pins xlconcat_2/In0]
connect_bd_net -net PS_FCLK_CLK1 [get_bd_pins ADC_clk_64M] [get_bd_pins axis_mux_0/clk] [get_bd_pins TestGen/ADC_clk_64M]
connect_bd_net [get_bd_pins TestGen/LED_GREEN] [get_bd_pins LED_GREEN1] [get_bd_pins axis_mux_0/select_input]
connect_bd_net [get_bd_pins TestGen/dout] [get_bd_pins axis_mux_0/input0_axis_tdata]
connect_bd_net [get_bd_pins TestGen/m_axis_data_tvalid] [get_bd_pins axis_mux_0/input0_axis_tvalid]
connect_bd_net [get_bd_pins TestGen/s_axis_config_tvalid] [get_bd_pins axis_mux_0/input1_axis_tvalid]
connect_bd_net [get_bd_pins axis_mux_0/output_axis_tdata] [get_bd_pins xlconcat_1/In1]
connect_bd_net [get_bd_pins s00_axis_aclk] [get_bd_pins TestGen/s00_axis_aclk]
connect_bd_net [get_bd_pins s_axi_aresetn] [get_bd_pins TestGen/s_axi_aresetn]
connect_bd_net [get_bd_pins xlconcat_1/dout] [get_bd_pins dout]
connect_bd_net [get_bd_pins xlconcat_2/dout] [get_bd_pins axis_mux_0/input1_axis_tdata]
connect_bd_net [get_bd_pins xlconstant_0/dout] [get_bd_pins xlconcat_1/In0]
connect_bd_net [get_bd_pins xlconstant_2/dout] [get_bd_pins xlconcat_2/In1]

current_bd_instance /ADC_TestGen/TestGen
connect_bd_intf_net [get_bd_intf_pins ctrl_s_axi] [get_bd_intf_pins dds_axi_interface_0/ctrl_s_axi]
connect_bd_intf_net -intf_net PS_M03_AXI [get_bd_intf_pins S_AXI] [get_bd_intf_pins axi_gpio_ADC_TEST/S_AXI]
connect_bd_intf_net [get_bd_intf_pins dds_axi_interface_0/ctrl_m_axis] [get_bd_intf_pins RF_test_10MHz/S_AXIS_CONFIG]
connect_bd_net -net PS_FCLK_CLK0 [get_bd_pins s00_axis_aclk] [get_bd_pins axi_gpio_ADC_TEST/s_axi_aclk]
connect_bd_net -net PS_FCLK_CLK1 [get_bd_pins ADC_clk_64M] \
  [get_bd_pins RF_test_10MHz/aclk] [get_bd_pins c_addsub_0/CLK] [get_bd_pins dds_compiler_1KHz/aclk] \
  [get_bd_pins mult_gen_AM_modulator/CLK] [get_bd_pins dds_axi_interface_0/ctrl_m_axis_aclk] \
  [get_bd_pins dds_axi_interface_0/ctrl_s_axi_aclk]
connect_bd_net -net RF_test_1MHz_m_axis_data_tdata [get_bd_pins RF_test_10MHz/m_axis_data_tdata] [get_bd_pins mult_gen_AM_modulator/A]
connect_bd_net -net RF_test_1MHz_m_axis_data_tvalid [get_bd_pins RF_test_10MHz/m_axis_data_tvalid] [get_bd_pins m_axis_data_tvalid]
connect_bd_net -net axi_gpio_dds_gpio2_io_o [get_bd_pins axi_gpio_ADC_TEST/gpio2_io_o] [get_bd_pins LED_GREEN]
connect_bd_net [get_bd_pins c_addsub_0/S] [get_bd_pins mult_gen_AM_modulator/B]
connect_bd_net [get_bd_pins dds_compiler_1KHz/m_axis_data_tdata] [get_bd_pins c_addsub_0/B]
connect_bd_net -net mult_gen_0_P [get_bd_pins mult_gen_AM_modulator/P] [get_bd_pins dout]
connect_bd_net [get_bd_pins s_axi_aresetn] [get_bd_pins axi_gpio_ADC_TEST/s_axi_aresetn]
connect_bd_net [get_bd_pins xlconstant_1/dout] [get_bd_pins s_axis_config_tvalid]
connect_bd_net [get_bd_pins xlconstant_2048/dout] [get_bd_pins c_addsub_0/A]
connect_bd_net [get_bd_pins xlconstant_2/dout] \
  [get_bd_pins dds_axi_interface_0/ctrl_m_axis_aresetn] [get_bd_pins dds_axi_interface_0/ctrl_s_axi_aresetn]

current_bd_instance /LEDdriver
connect_bd_intf_net -intf_net PS_M02_AXI [get_bd_intf_pins S_AXI] [get_bd_intf_pins axi_gpio_0/S_AXI]
connect_bd_net -net PS_FCLK_CLK0 [get_bd_pins s_axi_aclk] [get_bd_pins axi_gpio_0/s_axi_aclk]
connect_bd_net [get_bd_pins axi_gpio_0/gpio_io_o] [get_bd_pins xlconcat_0/In0]
connect_bd_net [get_bd_pins xlconcat_0/dout] [get_bd_pins LED]

current_bd_instance /I2S
connect_bd_intf_net -intf_net dds_compiler_0_M_AXIS_DATA [get_bd_intf_pins I2S_Transmitter_0/s00_axis] [get_bd_intf_pins dds_compiler_1KHz_sin_cos/M_AXIS_DATA]
connect_bd_net [get_bd_pins DivideBy10/clk_out] [get_bd_pins I2S_Transmitter_0/mclk]
connect_bd_net [get_bd_pins I2S_Transmitter_0/bclk] [get_bd_pins SCLK]
connect_bd_net [get_bd_pins I2S_Transmitter_0/lrclk] [get_bd_pins LRCLK]
connect_bd_net [get_bd_pins I2S_Transmitter_0/sdata] [get_bd_pins I2SDATA]
connect_bd_net -net PS_ARESETN [get_bd_pins s00_axis_aresetn] [get_bd_pins I2S_Transmitter_0/s00_axis_aresetn] [get_bd_pins DivideBy10/resetn]
connect_bd_net -net PS_FCLK_CLK0 [get_bd_pins s00_axis_aclk] \
  [get_bd_pins I2S_Transmitter_0/s00_axis_aclk] [get_bd_pins dds_compiler_1KHz_sin_cos/aclk] [get_bd_pins DivideBy10/clk]

current_bd_instance /DDC
connect_bd_intf_net [get_bd_intf_pins ctrl_s_axi] [get_bd_intf_pins LO/ctrl_s_axi]
connect_bd_net [get_bd_pins A] [get_bd_pins ComplexMult/A]
connect_bd_net [get_bd_pins CLK] [get_bd_pins ComplexMult/CLK] [get_bd_pins LO/s_axi_aclk]
connect_bd_net [get_bd_pins ComplexMult/P_cos] [get_bd_pins DDC_I]
connect_bd_net [get_bd_pins ComplexMult/P_sin] [get_bd_pins DDC_Q]
connect_bd_net [get_bd_pins LO/m_axis_data_tdata] [get_bd_pins ComplexMult/Din]
connect_bd_net [get_bd_pins aresetn] [get_bd_pins LO/aresetn]

current_bd_instance /DDC/LO
connect_bd_intf_net [get_bd_intf_pins ctrl_s_axi] [get_bd_intf_pins DDS_LO_axi_interface/ctrl_s_axi]
connect_bd_intf_net -intf_net dds_axi_interface_0_ctrl_m_axis [get_bd_intf_pins DDS_LO_axi_interface/ctrl_m_axis] [get_bd_intf_pins DDS_LO/S_AXIS_CONFIG]
connect_bd_net -net LocalOscillator_m_axis_data_tdata [get_bd_pins DDS_LO/m_axis_data_tdata] [get_bd_pins m_axis_data_tdata]
connect_bd_net [get_bd_pins aresetn] [get_bd_pins DDS_LO_axi_interface/ctrl_s_axi_aresetn]
connect_bd_net [get_bd_pins s_axi_aclk] \
  [get_bd_pins DDS_LO/aclk] [get_bd_pins DDS_LO_axi_interface/ctrl_m_axis_aclk] \
  [get_bd_pins DDS_LO_axi_interface/ctrl_s_axi_aclk]
connect_bd_net [get_bd_pins xlconstant_2/dout] [get_bd_pins DDS_LO_axi_interface/ctrl_m_axis_aresetn]

current_bd_instance /DDC/ComplexMult
connect_bd_net [get_bd_pins A] [get_bd_pins mult_sin/A] [get_bd_pins mult_cos/A]
connect_bd_net [get_bd_pins CLK] [get_bd_pins mult_sin/CLK] [get_bd_pins mult_cos/CLK]
connect_bd_net -net LocalOscillator_m_axis_data_tdata [get_bd_pins Din] [get_bd_pins xlslice_cos/Din] [get_bd_pins xlslice_sin/Din]
connect_bd_net [get_bd_pins mult_cos/P] [get_bd_pins P_cos]
connect_bd_net [get_bd_pins mult_sin/P] [get_bd_pins P_sin]
connect_bd_net [get_bd_pins xlslice_cos/Dout] [get_bd_pins mult_sin/B]
connect_bd_net [get_bd_pins xlslice_sin/Dout] [get_bd_pins mult_cos/B]

current_bd_instance /AM_demodulator
connect_bd_net -net FIR_I_m_axis_data_tdata [get_bd_pins B] [get_bd_pins I_square/B] [get_bd_pins I_square/A]
connect_bd_net -net FIR_Q_m_axis_data_tdata [get_bd_pins B1] [get_bd_pins Q_square/B] [get_bd_pins Q_square/A]
connect_bd_net -net PS_FCLK_CLK1 [get_bd_pins ADC_clk_64M] [get_bd_pins Q_square/CLK] [get_bd_pins c_addsub_0/CLK] [get_bd_pins I_square/CLK]
connect_bd_net [get_bd_pins c_addsub_0/S] [get_bd_pins sqrt32_0/P]
connect_bd_net -net mult_gen_0_P [get_bd_pins I_square/P] [get_bd_pins c_addsub_0/A]
connect_bd_net -net mult_gen_1_P [get_bd_pins Q_square/P] [get_bd_pins c_addsub_0/B]
connect_bd_net [get_bd_pins sqrt32_0/U] [get_bd_pins U]

current_bd_instance /FILTER
connect_bd_intf_net [get_bd_intf_pins ctrl_s_axi] [get_bd_intf_pins axi_interface_DEC_RATE_Q/ctrl_s_axi]
connect_bd_intf_net [get_bd_intf_pins ctrl_s_axi1] [get_bd_intf_pins axi_interface_DEC_RATE_I/ctrl_s_axi]
connect_bd_intf_net -intf_net S_AXI1_1 [get_bd_intf_pins S_AXI1] [get_bd_intf_pins axi_gpio_FILTER_GAIN/S_AXI]
connect_bd_intf_net -intf_net axi_interface_DEC_RATE_I_ctrl_m_axis [get_bd_intf_pins axi_interface_DEC_RATE_Q/ctrl_m_axis] [get_bd_intf_pins CIC_Q_1024/S_AXIS_CONFIG]
connect_bd_intf_net -intf_net axi_interface_DEC_RATE_Q_1_ctrl_m_axis [get_bd_intf_pins axi_interface_DEC_RATE_I/ctrl_m_axis] [get_bd_intf_pins CIC_I_1024/S_AXIS_CONFIG]
connect_bd_net -net CIC_I_128_m_axis_data_tdata [get_bd_pins CIC_I_1024/m_axis_data_tdata] [get_bd_pins mult_by_GAIN_Q/A]
connect_bd_net -net CIC_I_128_m_axis_data_tvalid [get_bd_pins CIC_I_1024/m_axis_data_tvalid] [get_bd_pins FIR_I_2/s_axis_data_tvalid]
connect_bd_net -net CIC_Q_128_m_axis_data_tdata [get_bd_pins CIC_Q_1024/m_axis_data_tdata] [get_bd_pins mult_by_GAIN_I/A]
connect_bd_net -net CIC_Q_128_m_axis_data_tvalid [get_bd_pins CIC_Q_1024/m_axis_data_tvalid] [get_bd_pins FIR_Q_2/s_axis_data_tvalid]
connect_bd_net -net DDC_I [get_bd_pins s_axis_data_tdata] [get_bd_pins CIC_I_1024/s_axis_data_tdata]
connect_bd_net -net DDC_Q [get_bd_pins s_axis_data_tdata1] [get_bd_pins CIC_Q_1024/s_axis_data_tdata]
connect_bd_net -net FIR_I_m_axis_data_tdata [get_bd_pins FIR_I_2/m_axis_data_tdata] [get_bd_pins m_axis_data_tdata1]
connect_bd_net -net FIR_Q_m_axis_data_tdata [get_bd_pins FIR_Q_2/m_axis_data_tdata] [get_bd_pins m_axis_data_tdata]
connect_bd_net -net PS_FCLK_CLK1 [get_bd_pins ADC_clk_64M] \
  [get_bd_pins CIC_I_1024/aclk] [get_bd_pins CIC_Q_1024/aclk] [get_bd_pins FIR_I_2/aclk] [get_bd_pins FIR_Q_2/aclk] \
  [get_bd_pins axi_interface_DEC_RATE_Q/ctrl_m_axis_aclk] [get_bd_pins axi_interface_DEC_RATE_Q/ctrl_s_axi_aclk] \
  [get_bd_pins axi_interface_DEC_RATE_I/ctrl_m_axis_aclk] [get_bd_pins axi_interface_DEC_RATE_I/ctrl_s_axi_aclk]
connect_bd_net [get_bd_pins aclk] [get_bd_pins axi_gpio_FILTER_GAIN/s_axi_aclk]
connect_bd_net -net aresetn1_1 [get_bd_pins aresetn1] [get_bd_pins axi_gpio_FILTER_GAIN/s_axi_aresetn]
connect_bd_net [get_bd_pins aresetn] \
  [get_bd_pins axi_interface_DEC_RATE_Q/ctrl_s_axi_aresetn] [get_bd_pins axi_interface_DEC_RATE_I/ctrl_m_axis_aresetn] \
  [get_bd_pins axi_interface_DEC_RATE_I/ctrl_s_axi_aresetn]
connect_bd_net [get_bd_pins axi_gpio_FILTER_GAIN/gpio_io_o] [get_bd_pins mult_by_GAIN_Q/B] [get_bd_pins mult_by_GAIN_I/B]
connect_bd_net -net mult_by_4_I_P [get_bd_pins mult_by_GAIN_I/P] [get_bd_pins FIR_Q_2/s_axis_data_tdata]
connect_bd_net -net mult_by_4_Q_P [get_bd_pins mult_by_GAIN_Q/P] [get_bd_pins FIR_I_2/s_axis_data_tdata]
connect_bd_net [get_bd_pins s_axis_data_tvalid] [get_bd_pins CIC_Q_1024/s_axis_data_tvalid] [get_bd_pins CIC_I_1024/s_axis_data_tvalid]
connect_bd_net [get_bd_pins xlconstant_2/dout] [get_bd_pins axi_interface_DEC_RATE_Q/ctrl_m_axis_aresetn]

current_bd_instance /
connect_bd_intf_net [get_bd_intf_pins PS/M00_AXI] [get_bd_intf_pins axis_capture_RF/ctrl_s_axi]
connect_bd_intf_net [get_bd_intf_pins PS/M01_AXI] [get_bd_intf_pins FILTER/ctrl_s_axi]
connect_bd_intf_net [get_bd_intf_pins LEDdriver/S_AXI] [get_bd_intf_pins PS/M02_AXI]
connect_bd_intf_net [get_bd_intf_pins PS/M03_AXI] [get_bd_intf_pins ADC_TestGen/S_AXI]
connect_bd_intf_net [get_bd_intf_pins PS/M04_AXI] [get_bd_intf_pins ADC_TestGen/ctrl_s_axi]
connect_bd_intf_net [get_bd_intf_pins PS/M05_AXI] [get_bd_intf_pins FILTER/ctrl_s_axi1]
connect_bd_intf_net [get_bd_intf_pins PS/M06_AXI] [get_bd_intf_pins ADC_TestGen/s_axi1]
connect_bd_intf_net [get_bd_intf_pins axi_axis_writer_LED_RED/s_axi] [get_bd_intf_pins PS/M07_AXI]
connect_bd_intf_net [get_bd_intf_pins PS/M08_AXI] [get_bd_intf_pins DDC/ctrl_s_axi]
connect_bd_intf_net [get_bd_intf_pins PS/M09_AXI] [get_bd_intf_pins FILTER/S_AXI1]
connect_bd_intf_net -intf_net processing_system7_0_DDR [get_bd_intf_ports DDR] [get_bd_intf_pins PS/DDR]
connect_bd_intf_net -intf_net processing_system7_0_FIXED_IO [get_bd_intf_ports FIXED_IO] [get_bd_intf_pins PS/FIXED_IO]
connect_bd_intf_net -intf_net processing_system7_0_MDIO_ETHERNET_0 [get_bd_intf_ports MDIO_ETHERNET_0_0] [get_bd_intf_pins PS/MDIO_ETHERNET_0_0]
connect_bd_net [get_bd_pins ADC_TestGen/LED_GREEN1] [get_bd_ports LED_GREEN]
connect_bd_net [get_bd_ports ADC_in] [get_bd_pins ADC_TestGen/ADC_in]
connect_bd_net -net ADCandTestGen_output_axis_tvalid [get_bd_pins ADC_TestGen/output_axis_tvalid] [get_bd_pins axis_capture_RF/capture_valid]
connect_bd_net [get_bd_pins AM_demodulator/U] [get_bd_pins xlconcat_0/In0] [get_bd_pins xlconcat_0/In1]
connect_bd_net -net DDC_I [get_bd_pins DDC/DDC_I] [get_bd_pins FILTER/s_axis_data_tdata]
connect_bd_net -net DDC_Q [get_bd_pins DDC/DDC_Q] [get_bd_pins FILTER/s_axis_data_tdata1]
connect_bd_net -net DivideBy2_clk_out [get_bd_pins DivideBy10/clk_out] [get_bd_pins I2S_Transmitter_0/mclk]
connect_bd_net -net ENET0_GMII_RX_CLK_0_1 [get_bd_ports ENET0_GMII_RX_CLK_0] [get_bd_pins PS/ENET0_GMII_RX_CLK_0]
connect_bd_net -net ENET0_GMII_RX_DV_0_1 [get_bd_ports ENET0_GMII_RX_DV_0] [get_bd_pins PS/ENET0_GMII_RX_DV_0]
connect_bd_net -net ENET0_GMII_TX_CLK_0_1 [get_bd_ports ENET0_GMII_TX_CLK_0] [get_bd_pins PS/ENET0_GMII_TX_CLK_0]
connect_bd_net -net FIR_I_m_axis_data_tdata [get_bd_pins FILTER/m_axis_data_tdata1] [get_bd_pins AM_demodulator/B]
connect_bd_net -net FIR_Q_m_axis_data_tdata [get_bd_pins FILTER/m_axis_data_tdata] [get_bd_pins AM_demodulator/B1]
connect_bd_net [get_bd_pins I2S_Transmitter_0/bclk] [get_bd_ports SCLK]
connect_bd_net [get_bd_pins I2S_Transmitter_0/lrclk] [get_bd_ports LRCLK]
connect_bd_net [get_bd_pins I2S_Transmitter_0/sdata] [get_bd_ports I2SDATA]
connect_bd_net -net In0_0_1 [get_bd_ports enet0_gmii_rxd] [get_bd_pins PS/enet0_gmii_rxd]
connect_bd_net [get_bd_ports OTR] [get_bd_pins ADC_TestGen/OTR]
connect_bd_net [get_bd_pins PS/ARESETN] \
  [get_bd_pins axis_capture_RF/ctrl_s_axi_aresetn] [get_bd_pins I2S/s00_axis_aresetn] \
  [get_bd_pins I2S_Transmitter_0/s00_axis_aresetn] [get_bd_pins DivideBy10/resetn] [get_bd_pins FILTER/aresetn1] \
  [get_bd_pins ADC_TestGen/s_axi_aresetn]
connect_bd_net -net PS_FCLK_CLK0 [get_bd_pins PS/FCLK_CLK0_100M] \
  [get_bd_pins axis_capture_RF/ctrl_s_axi_aclk] [get_bd_pins LEDdriver/s_axi_aclk] [get_bd_pins I2S/s00_axis_aclk] \
  [get_bd_pins ADC_TestGen/s00_axis_aclk] [get_bd_pins I2S_Transmitter_0/s00_axis_aclk] [get_bd_pins DivideBy10/clk] \
  [get_bd_pins FILTER/aclk]
connect_bd_net -net PS_FCLK_CLK1 [get_bd_pins PS/FCLK_CLK1_64M] \
  [get_bd_pins axis_capture_RF/capture_clk] [get_bd_ports ADC_clk_64M] [get_bd_pins ADC_TestGen/ADC_clk_64M] \
  [get_bd_pins DDC/CLK] [get_bd_pins AM_demodulator/ADC_clk_64M] [get_bd_pins rst_ps7_0_64M/slowest_sync_clk] \
  [get_bd_pins FILTER/ADC_clk_64M] [get_bd_pins axi_axis_writer_LED_RED/aclk]
connect_bd_net -net PS_FCLK_CLK3_0 [get_bd_pins PS/FCLK_CLK3_25M] [get_bd_ports FCLK_CLK3_0]
connect_bd_net [get_bd_pins PS/FCLK_RESET0_N] [get_bd_pins rst_ps7_0_64M/ext_reset_in]
connect_bd_net [get_bd_pins axi_axis_writer_LED_RED/m_axis_tdata] [get_bd_pins xlslice_1/Din]
connect_bd_net -net processing_system7_0_ENET0_GMII_TX_EN [get_bd_pins PS/ENET0_GMII_TX_EN_0] [get_bd_ports ENET0_GMII_TX_EN_0]
connect_bd_net [get_bd_pins rst_ps7_0_64M/peripheral_aresetn] \
  [get_bd_pins DDC/aresetn] [get_bd_pins PS/M04_ARESETN] [get_bd_pins FILTER/aresetn] [get_bd_pins ADC_TestGen/aresetn] \
  [get_bd_pins axi_axis_writer_LED_RED/aresetn]
connect_bd_net [get_bd_pins xlconcat_0/dout] [get_bd_pins I2S_Transmitter_0/s00_axis_tdata]
connect_bd_net -net xlconcat_1_dout [get_bd_pins ADC_TestGen/dout] [get_bd_pins axis_capture_RF/capture_data] [get_bd_pins xlslice_0/Din]
connect_bd_net [get_bd_pins xlconstant_0/dout] [get_bd_pins FILTER/s_axis_data_tvalid]
connect_bd_net [get_bd_pins xlconstant_1/dout] [get_bd_pins I2S_Transmitter_0/s00_axis_tvalid]
connect_bd_net -net xlslice_0_Dout [get_bd_pins PS/enet0_gmii_txd] [get_bd_ports enet0_gmii_txd]
connect_bd_net [get_bd_pins xlslice_0/Dout] [get_bd_pins DDC/A]
connect_bd_net [get_bd_pins xlslice_1/Dout] [get_bd_ports LED_RED]

# ---- address map ----
assign_bd_address -offset 0x41200000 -range 64K -target_address_space [get_bd_addr_spaces PS/processing_system7_0/Data] [get_bd_addr_segs LEDdriver/axi_gpio_0/S_AXI/Reg]
assign_bd_address -offset 0x41210000 -range 64K -target_address_space [get_bd_addr_spaces PS/processing_system7_0/Data] [get_bd_addr_segs ADC_TestGen/TestGen/axi_gpio_ADC_TEST/S_AXI/Reg]
assign_bd_address -offset 0x41220000 -range 64K -target_address_space [get_bd_addr_spaces PS/processing_system7_0/Data] [get_bd_addr_segs FILTER/axi_gpio_FILTER_GAIN/S_AXI/Reg]
assign_bd_address -offset 0x43C00000 -range 64K -target_address_space [get_bd_addr_spaces PS/processing_system7_0/Data] [get_bd_addr_segs axis_capture_RF/ctrl_s_axi/reg0]
assign_bd_address -offset 0x43C10000 -range 64K -target_address_space [get_bd_addr_spaces PS/processing_system7_0/Data] [get_bd_addr_segs FILTER/axi_interface_DEC_RATE_Q/ctrl_s_axi/reg0]
assign_bd_address -offset 0x43C20000 -range 64K -target_address_space [get_bd_addr_spaces PS/processing_system7_0/Data] [get_bd_addr_segs ADC_TestGen/TestGen/dds_axi_interface_0/ctrl_s_axi/reg0]
assign_bd_address -offset 0x43C30000 -range 64K -target_address_space [get_bd_addr_spaces PS/processing_system7_0/Data] [get_bd_addr_segs FILTER/axi_interface_DEC_RATE_I/ctrl_s_axi/reg0]
assign_bd_address -offset 0x43C50000 -range 64K -target_address_space [get_bd_addr_spaces PS/processing_system7_0/Data] [get_bd_addr_segs axi_axis_writer_LED_RED/s_axi/reg0]
assign_bd_address -offset 0x43C60000 -range 64K -target_address_space [get_bd_addr_spaces PS/processing_system7_0/Data] [get_bd_addr_segs DDC/LO/DDS_LO_axi_interface/ctrl_s_axi/reg0]

set_property USER_COMMENTS.comment_0 {PS groups:
- Programmable System(CPU)
- Reset
- AXI control
- Ethernet} [current_bd_design]

validate_bd_design
save_bd_design
